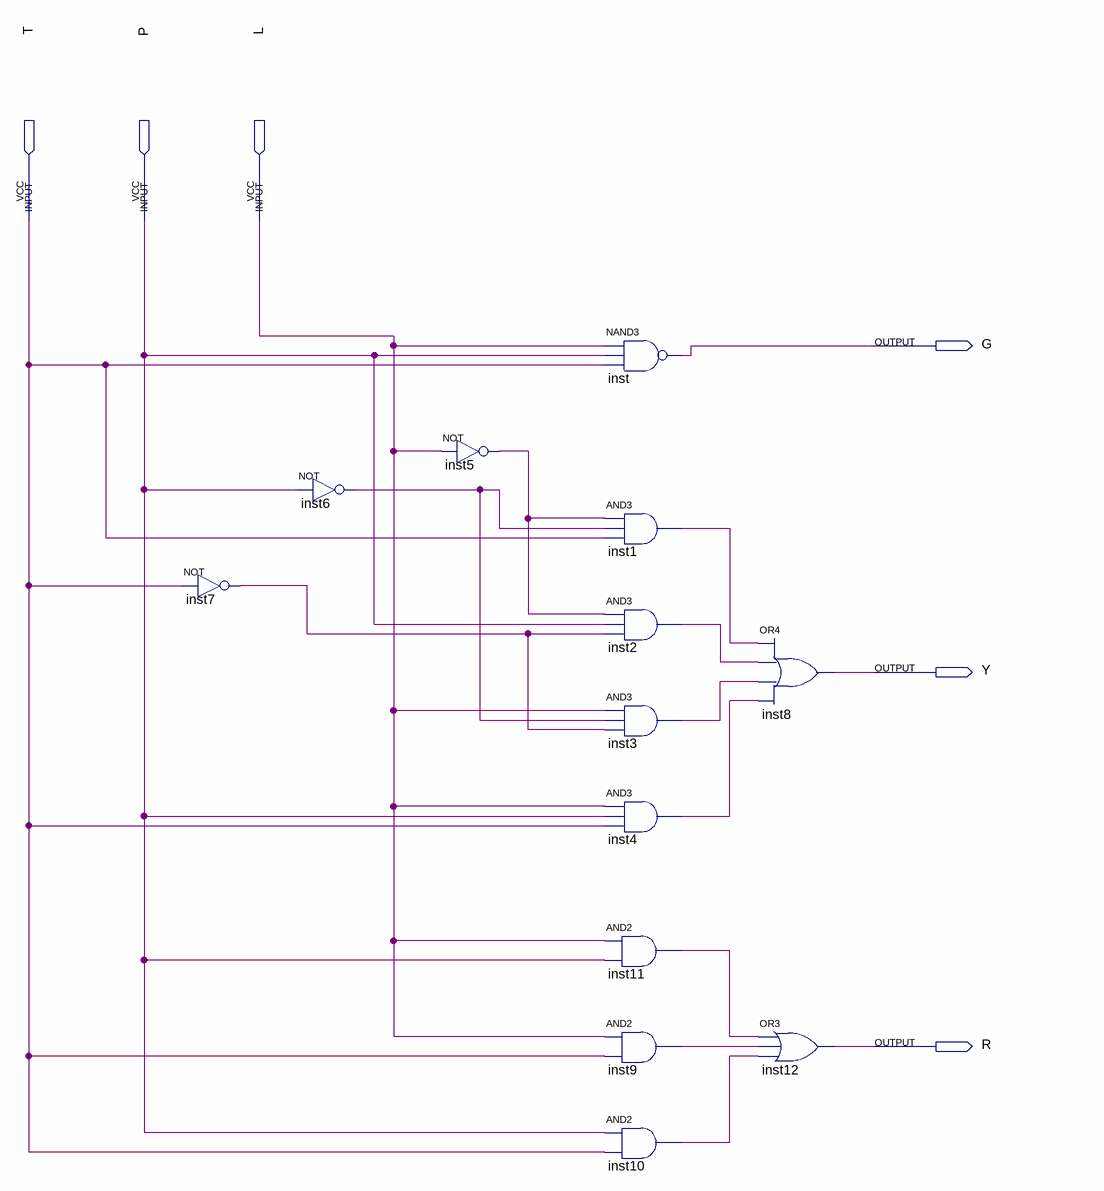
[diagram p0: schematic sheet]
// Quartus schematic block2.bdf as structural Verilog: 13 symbols, 6 pins
module block2 (
  input  T,
  input  P,
  input  L,
  output G,
  output Y,
  output R
);

  wire inst1_out, inst2_out, inst3_out, inst4_out, inst5_out, inst6_out, inst7_out, inst9_out, inst10_out,
       inst11_out;

  not inst7 (inst7_out, T);
  not inst6 (inst6_out, P);
  not inst5 (inst5_out, L);
  nand inst (G, L, P, T);
  and inst1 (inst1_out, inst5_out, inst6_out, T);
  and inst2 (inst2_out, inst5_out, P, inst7_out);
  and inst3 (inst3_out, L, inst6_out, inst7_out);
  and inst4 (inst4_out, L, P, T);
  and inst11 (inst11_out, L, P);
  and inst9 (inst9_out, L, T);
  and inst10 (inst10_out, P, T);
  or inst8 (Y, inst1_out, inst2_out, inst3_out, inst4_out);
  or inst12 (R, inst11_out, inst9_out, inst10_out);
endmodule
